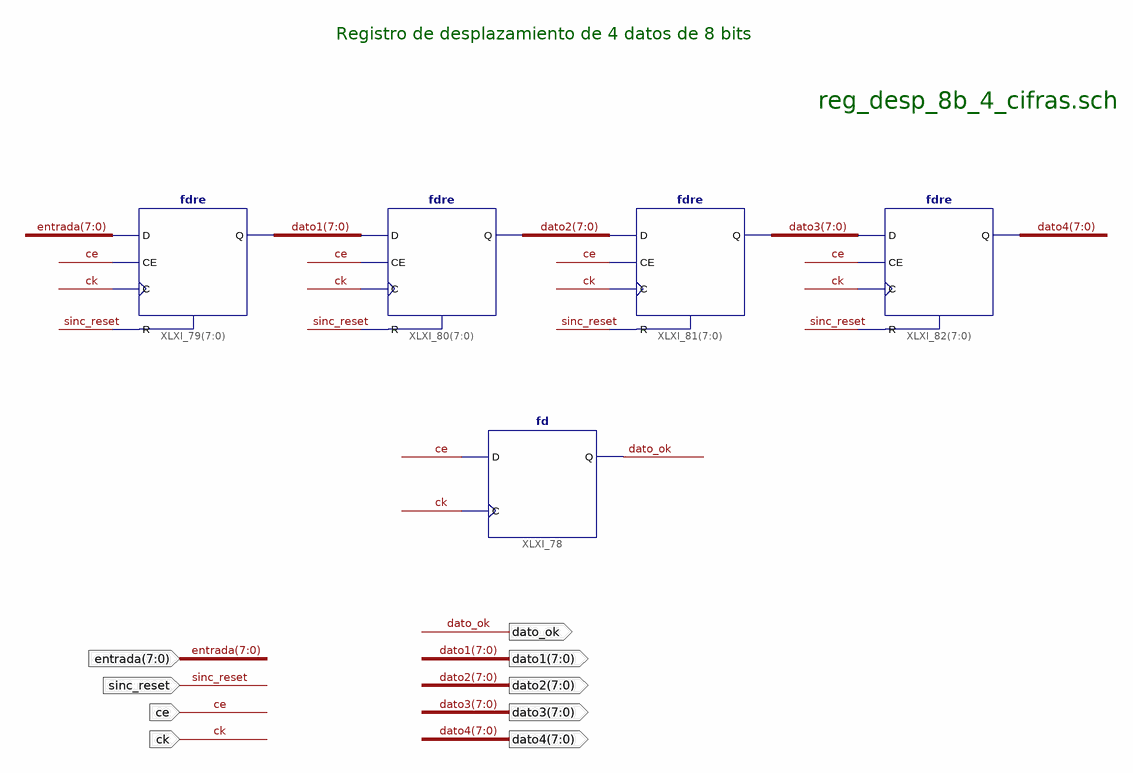
[diagram p0: schematic sheet 1]
// Xilinx ISE schematic reg_desp_8b_4_cifras.sch (spartan6) as structural Verilog: 5 symbols, 9 ports
module reg_desp_8b_4_cifras (
  input  ck,
  input  ce,
  input  sinc_reset,
  input  [7:0] entrada,
  output dato_ok,
  output [7:0] dato4,
  output [7:0] dato3,
  output [7:0] dato2,
  output [7:0] dato1
);

  fd XLXI_78 (.C(ck), .D(ce), .Q(dato_ok));
  fdre XLXI_79[7:0] (.C(ck), .CE(ce), .D(entrada), .R(sinc_reset), .Q(dato1));
  fdre XLXI_80[7:0] (.C(ck), .CE(ce), .D(dato1), .R(sinc_reset), .Q(dato2));
  fdre XLXI_81[7:0] (.C(ck), .CE(ce), .D(dato2), .R(sinc_reset), .Q(dato3));
  fdre XLXI_82[7:0] (.C(ck), .CE(ce), .D(dato3), .R(sinc_reset), .Q(dato4));

  // Notes on the sheet:
  //   Registro de desplazamiento de 4 datos de 8 bits
  //   reg_desp_8b_4_cifras.sch
endmodule
